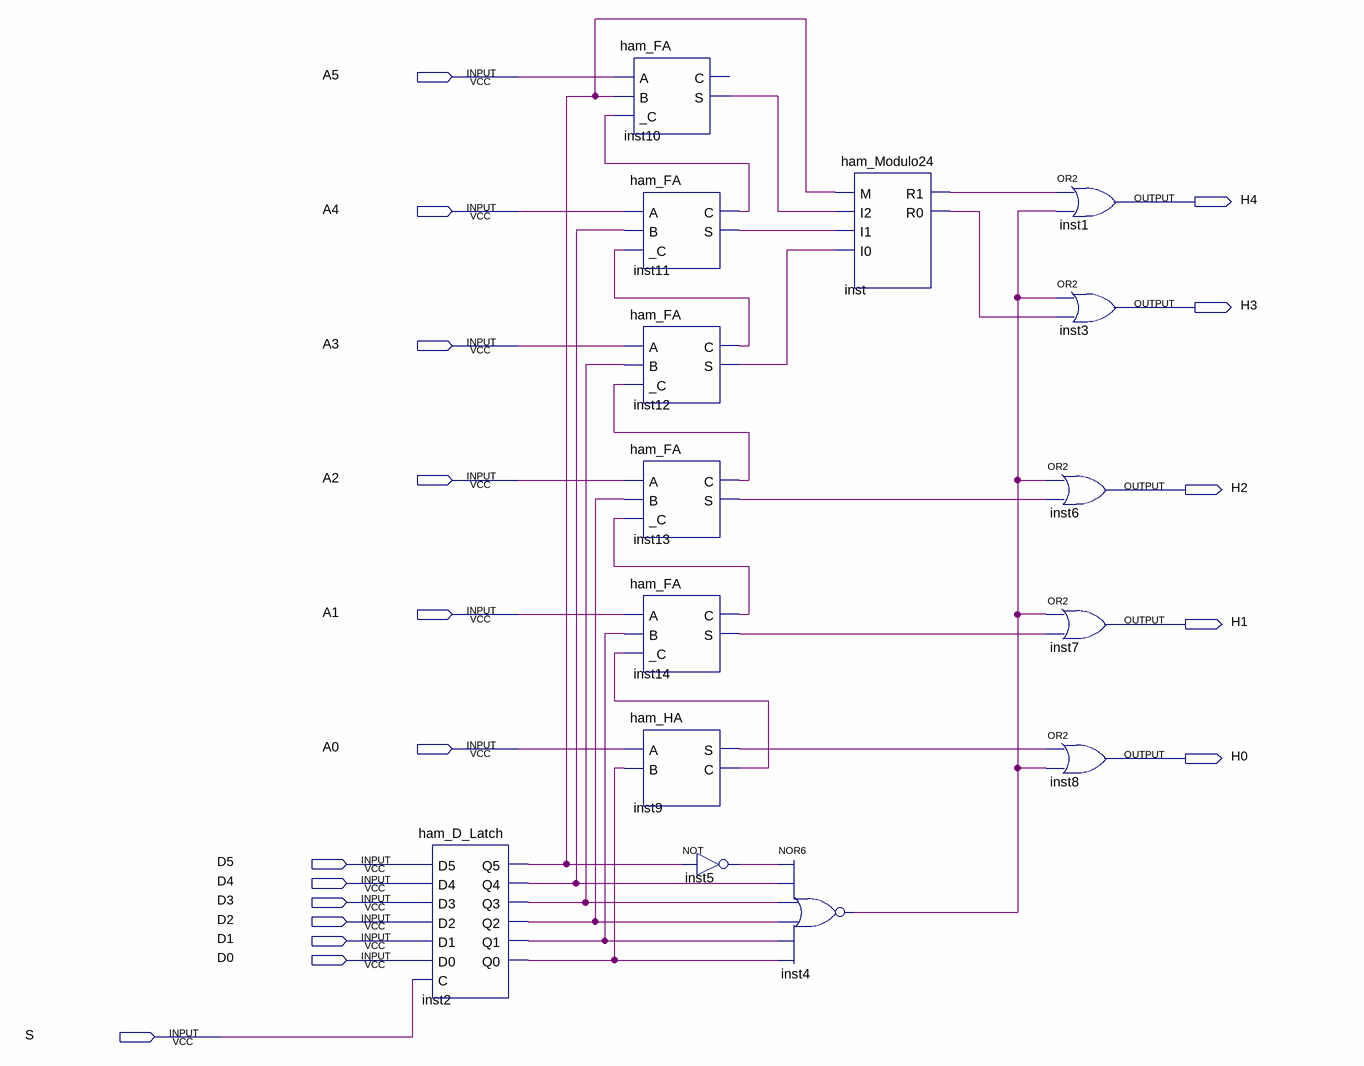
[diagram p0: schematic sheet]
// Quartus schematic ham_TimeAdder.bdf as structural Verilog: 15 symbols, 18 pins
module ham_TimeAdder (
  input  A5,
  input  A4,
  input  A3,
  input  A2,
  input  A1,
  input  A0,
  input  D5,
  input  D4,
  input  D3,
  input  D2,
  input  D1,
  input  D0,
  input  S,
  output H4,
  output H3,
  output H2,
  output H1,
  output H0
);

  wire inst2_q0, inst2_q1, inst2_q2, inst2_q3, inst2_q4, inst2_q5, inst4_out, inst5_out, inst9_c, inst9_s,
       inst10_s, inst11_c, inst11_s, inst12_c, inst12_s, inst13_c, inst13_s, inst14_c, inst14_s, inst_r0,
       inst_r1;

  ham_D_Latch inst2 (
    .D5(D5), .D4(D4), .D3(D3), .D2(D2), .D1(D1), .D0(D0), .C(S), .Q5(inst2_q5), .Q4(inst2_q4), .Q3(inst2_q3),
    .Q2(inst2_q2), .Q1(inst2_q1), .Q0(inst2_q0));
  ham_FA inst10 (.A(A5), .B(inst2_q5), ._C(inst11_c), .S(inst10_s));  // open: C
  ham_FA inst11 (.A(A4), .B(inst2_q4), ._C(inst12_c), .C(inst11_c), .S(inst11_s));
  ham_FA inst12 (.A(A3), .B(inst2_q3), ._C(inst13_c), .C(inst12_c), .S(inst12_s));
  ham_FA inst13 (.A(A2), .B(inst2_q2), ._C(inst14_c), .C(inst13_c), .S(inst13_s));
  ham_FA inst14 (.A(A1), .B(inst2_q1), ._C(inst9_c), .C(inst14_c), .S(inst14_s));
  ham_HA inst9 (.A(A0), .B(inst2_q0), .S(inst9_s), .C(inst9_c));
  not inst5 (inst5_out, inst2_q5);
  nor inst4 (inst4_out, inst5_out, inst2_q4, inst2_q3, inst2_q2, inst2_q1, inst2_q0);
  ham_Modulo24 inst (.M(inst2_q5), .I2(inst10_s), .I1(inst11_s), .I0(inst12_s), .R1(inst_r1), .R0(inst_r0));
  or inst1 (H4, inst_r1, inst4_out);
  or inst3 (H3, inst4_out, inst_r0);
  or inst6 (H2, inst4_out, inst13_s);
  or inst7 (H1, inst4_out, inst14_s);
  or inst8 (H0, inst9_s, inst4_out);
endmodule
